# EAGLE design OneBoard (EAGLE 9.0.1)
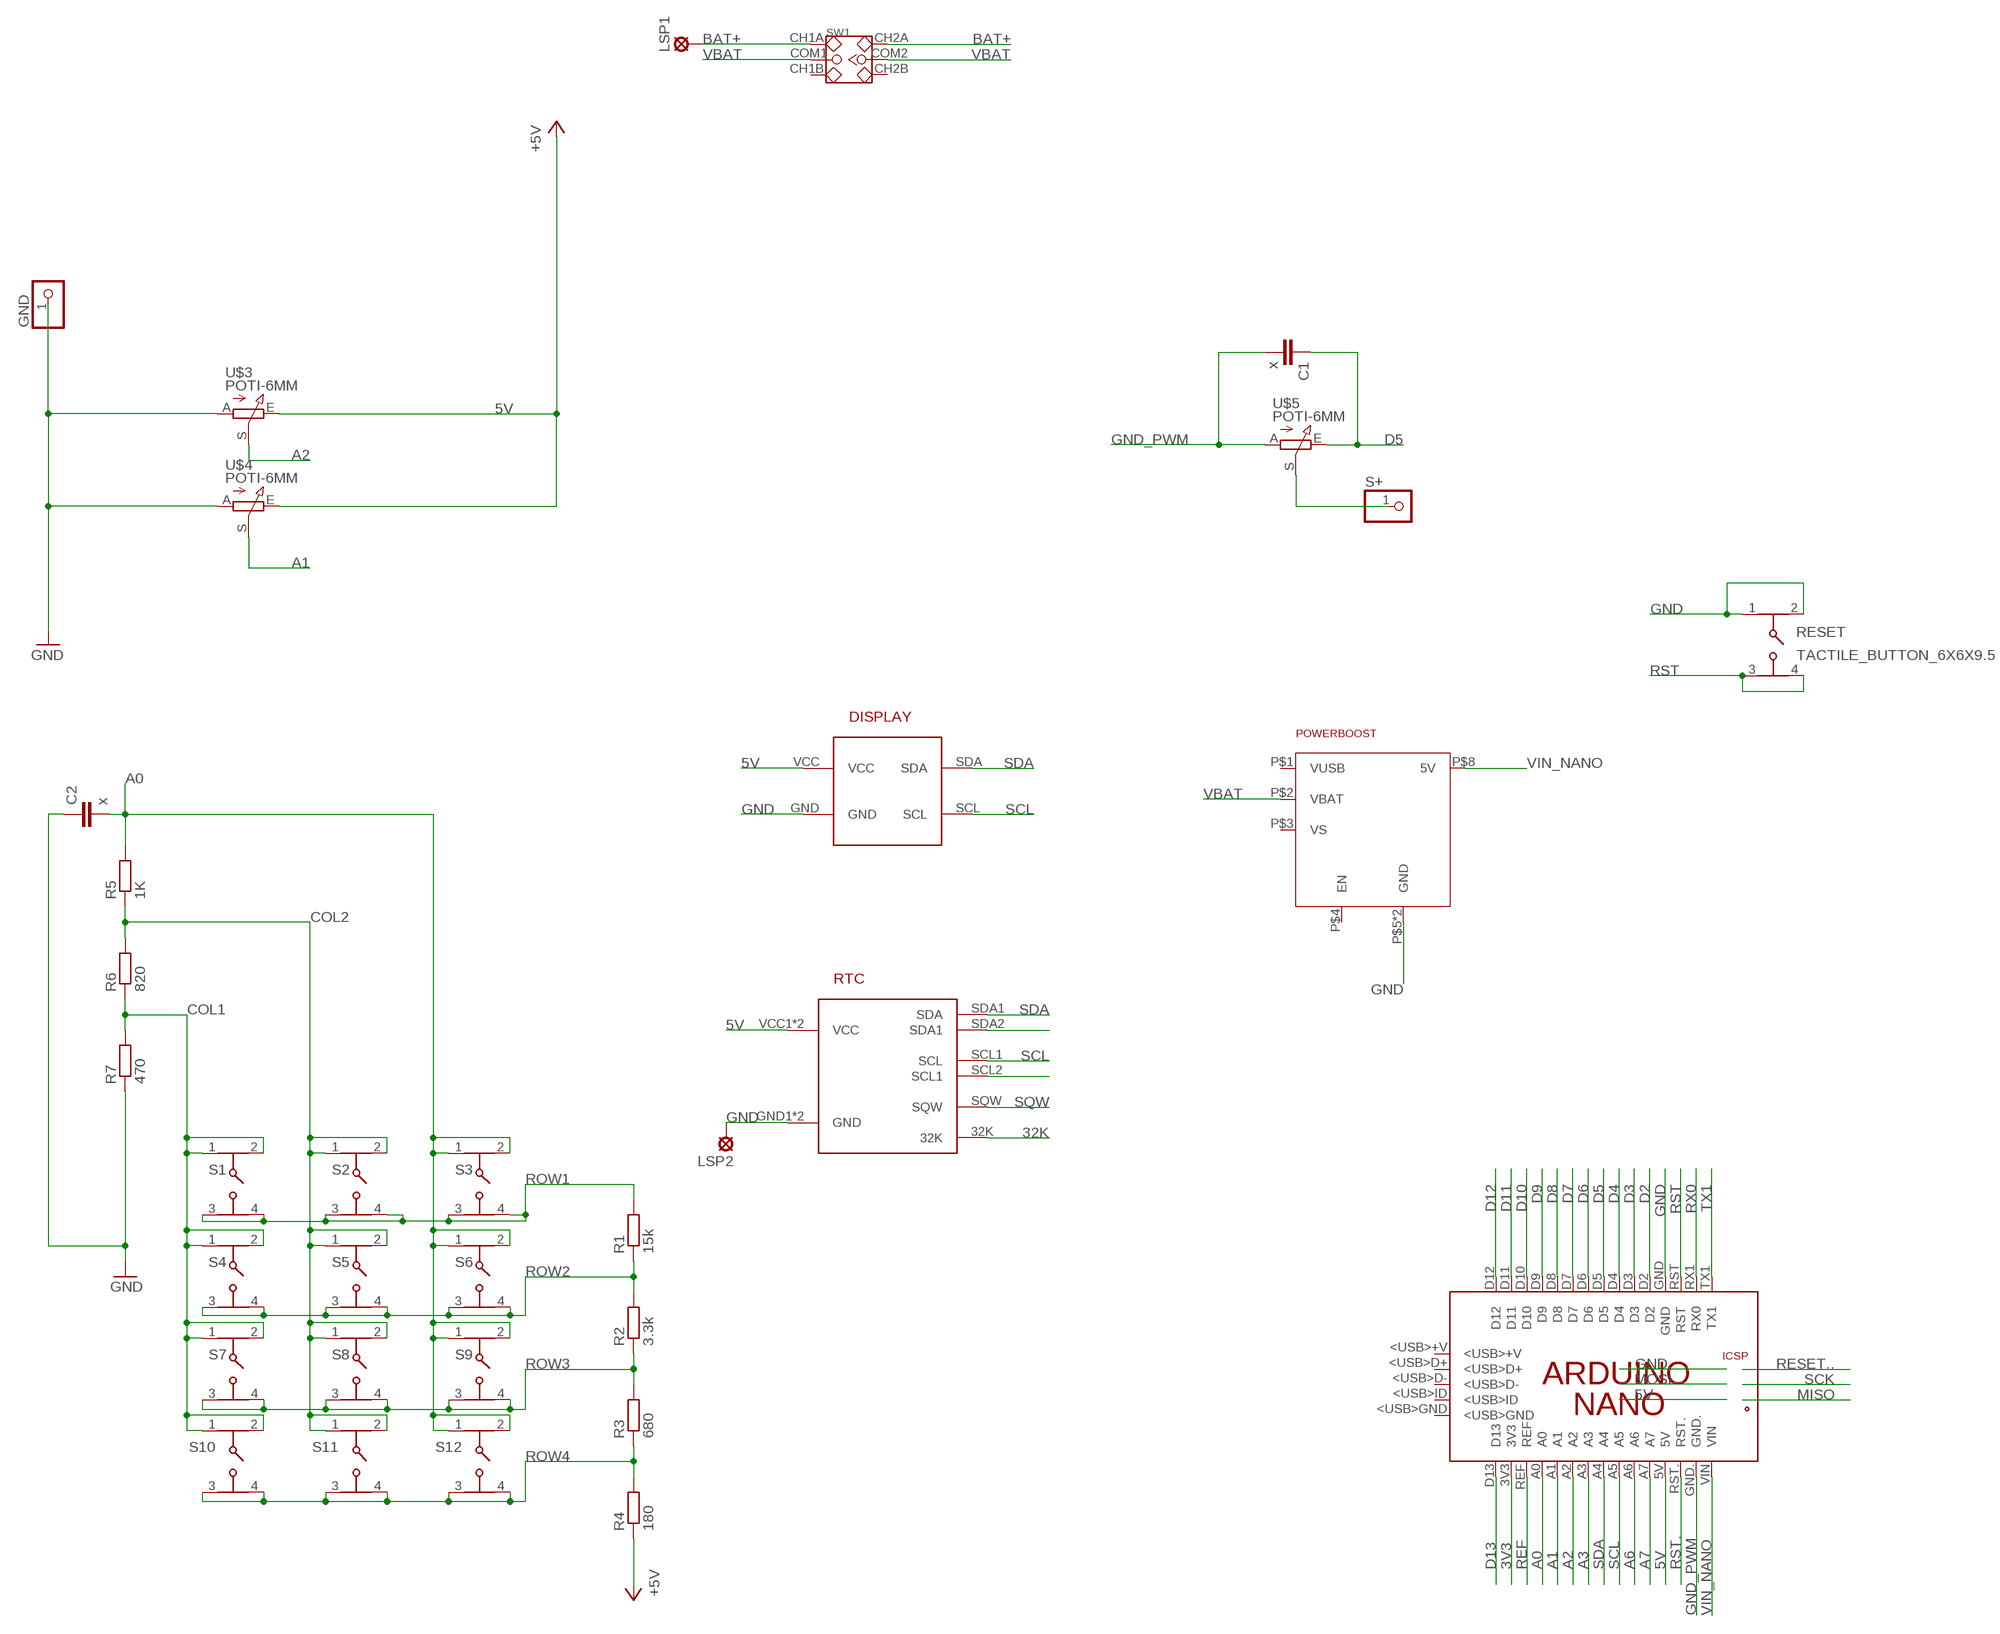
[diagram p0: schematic, sheet 1]

## Parts
C1  x  C-EU025-025X050  [C025-025X050]
C2  x  C-EU025-025X050  [C025-025X050]
DISPLAY  OLED_BREAKOUT  [OLED_128X32_BREAKOUT]
GND  PINHD-1X1  [1X01]
LSP1  LSP11  [LSP11]
LSP2  LSP11  [LSP11]
POWERBOOST  ADAFRUIT_POWERBOOST_1000C  [ADAFRUIT_POWERBOOST_1000C]
R1  15k  R-EU_R0603  [R0603]
R2  3.3k  R-EU_R0603  [R0603]
R3  680  R-EU_R0603  [R0603]
R4  180  R-EU_R0603  [R0603]
R5  1K  R-EU_R0603  [R0603]
R6  820  R-EU_R0603  [R0603]
R7  470  R-EU_R0603  [R0603]
RESET  TACTILE_BUTTON_6X6X9.5  [TACTILE_SWITCH_PTH_6.0MM]
RTC  DS3231_BREAKOUT  [DS3231_BREAKOUT]
S1  TACTILE_BUTTON_6X6X9.5  [TACTILE_SWITCH_PTH_6.0MM]
S2  TACTILE_BUTTON_6X6X9.5  [TACTILE_SWITCH_PTH_6.0MM]
S3  TACTILE_BUTTON_6X6X9.5  [TACTILE_SWITCH_PTH_6.0MM]
S4  TACTILE_BUTTON_6X6X9.5  [TACTILE_SWITCH_PTH_6.0MM]
S5  TACTILE_BUTTON_6X6X9.5  [TACTILE_SWITCH_PTH_6.0MM]
S6  TACTILE_BUTTON_6X6X9.5  [TACTILE_SWITCH_PTH_6.0MM]
S7  TACTILE_BUTTON_6X6X9.5  [TACTILE_SWITCH_PTH_6.0MM]
S8  TACTILE_BUTTON_6X6X9.5  [TACTILE_SWITCH_PTH_6.0MM]
S9  TACTILE_BUTTON_6X6X9.5  [TACTILE_SWITCH_PTH_6.0MM]
S10  TACTILE_BUTTON_6X6X9.5  [TACTILE_SWITCH_PTH_6.0MM]
S11  TACTILE_BUTTON_6X6X9.5  [TACTILE_SWITCH_PTH_6.0MM]
S12  TACTILE_BUTTON_6X6X9.5  [TACTILE_SWITCH_PTH_6.0MM]
S+  PINHD-1X1  [1X01]
SW1  DIP-TOGGLE-SWITCH-2CH-(2X3P-2.54)  [SW6-2.54-9.0X3.5X3.2+2.0MM]
U$3  POTI-6MM  [POTI-6MM]
U$4  POTI-6MM  [POTI-6MM]
U$5  POTI-6MM  [POTI-6MM]
U$7  ARDUINO-NANO  [ARDUINO_NANO]

## Nets
3V3: U$7.3V3
5V: DISPLAY.VCC R4.1 RTC.VCC1(VCC) RTC.VCC2(VCC) U$3.E U$4.E U$7.5V U$7.5V. ; supply symbol labelled +5V
32K [Signal]: RTC.32K
A0 [Signal]: C2.2 R5.2 S3.1 S3.2 S6.1 S6.2 S9.1 S9.2 S12.1 S12.2 U$7.A0
A1 [Signal]: U$4.S U$7.A1
A2 [Signal]: U$3.S U$7.A2
A3 [Signal]: U$7.A3
A6: U$7.A6
A7: U$7.A7
BAT+: LSP1.MP SW1.CH1A SW1.CH2A
COL1: R6.1 R7.2 S1.1 S1.2 S4.1 S4.2 S7.1 S7.2 S10.1 S10.2
COL2: R5.1 R6.2 S2.1 S2.2 S5.1 S5.2 S8.1 S8.2 S11.1 S11.2
D2: U$7.D2
D3: U$7.D3
D4: U$7.D4
D5: C1.1 U$5.E U$7.D5
D6: U$7.D6
D7: U$7.D7
D8: U$7.D8
D9: U$7.D9
D10: U$7.D10
D11: U$7.D11
D12: U$7.D12
D13: U$7.D13
GND: C2.1 DISPLAY.GND GND.1 LSP2.MP POWERBOOST.P$5(GND) POWERBOOST.P$7(GND) R7.1 RESET.1 RESET.2 RTC.GND1(GND) RTC.GND2(GND) U$3.A U$4.A U$7.GND U$7.GND_
GND_PWM [Signal]: C1.2 U$5.A U$7.GND.
MISO: U$7.MISO
MOSI: U$7.MOSI
N$1: RTC.SDA2(SDA1)
N$2: RTC.SCL2(SCL1)
REF: U$7.REF
RESET..: U$7.RESET..
ROW1: R1.2 S1.3 S1.4 S2.3 S2.4 S3.3 S3.4
ROW2: R1.1 R2.2 S4.3 S4.4 S5.3 S5.4 S6.3 S6.4
ROW3: R2.1 R3.2 S7.3 S7.4 S8.3 S8.4 S9.3 S9.4
ROW4: R3.1 R4.2 S10.3 S10.4 S11.3 S11.4 S12.3 S12.4
RST: RESET.3 RESET.4 U$7.RST
RST.: U$7.RST.
RX0: U$7.RX1(RX0)
S+ [Signal]: S+.1 U$5.S
SCK: U$7.SCK
SCL [Signal]: DISPLAY.SCL RTC.SCL1(SCL) U$7.A5
SDA [Signal]: DISPLAY.SDA RTC.SDA1(SDA) U$7.A4
SQW [Signal]: RTC.SQW
TX1: U$7.TX1
VBAT: POWERBOOST.P$2(VBAT) SW1.COM1 SW1.COM2
VIN_NANO: POWERBOOST.P$8(5V) U$7.VIN
Unconnected: POWERBOOST.P$4(EN) SW1.CH1B SW1.CH2B U$7.<USB>+V U$7.<USB>D+ U$7.<USB>D- U$7.<USB>GND U$7.<USB>ID

## Power pins joined to a net without a drawn wire
VS: POWERBOOST.P$3(VS)
VUSB: POWERBOOST.P$1(VUSB)

## Library data of the parts
C1 C2 = rcl:C-EU: CAPACITOR, European symbol; SPICEPREFIX: C
DISPLAY = My Breakout Boards:OLED_BREAKOUT
GND S+ = pinhead:PINHD-1X1: PIN HEADER
LSP1 LSP2 = solpad:LSP11: SOLDER PAD drill 1.1 mm
POWERBOOST = My Breakout Boards:ADAFRUIT_POWERBOOST_1000C
R1-R7 = rcl:R-EU_: RESISTOR, European symbol; SPICEPREFIX: R
RESET S1-S12 = Pat Sonstiges:TACTILE_BUTTON_6X6X9.5
RTC = My Breakout Boards:DS3231_BREAKOUT
SW1 = Seeed-Switch:DIP-TOGGLE-SWITCH-2CH-(2X3P-2.54): 311010004; MPN: MS-22D18 G2 ROHS
U$3-U$5 = Pat Sonstiges:POTI-
U$7 = My Boards:ARDUINO-NANO

## Net classes
0 GND: width 0.254 mm, drill 0.8 mm, clearance 0.254 mm
1 Signal: width 0.254 mm, drill 0.8 mm, clearance 0.254 mm to class 0, clearance 0.254 mm

## Board
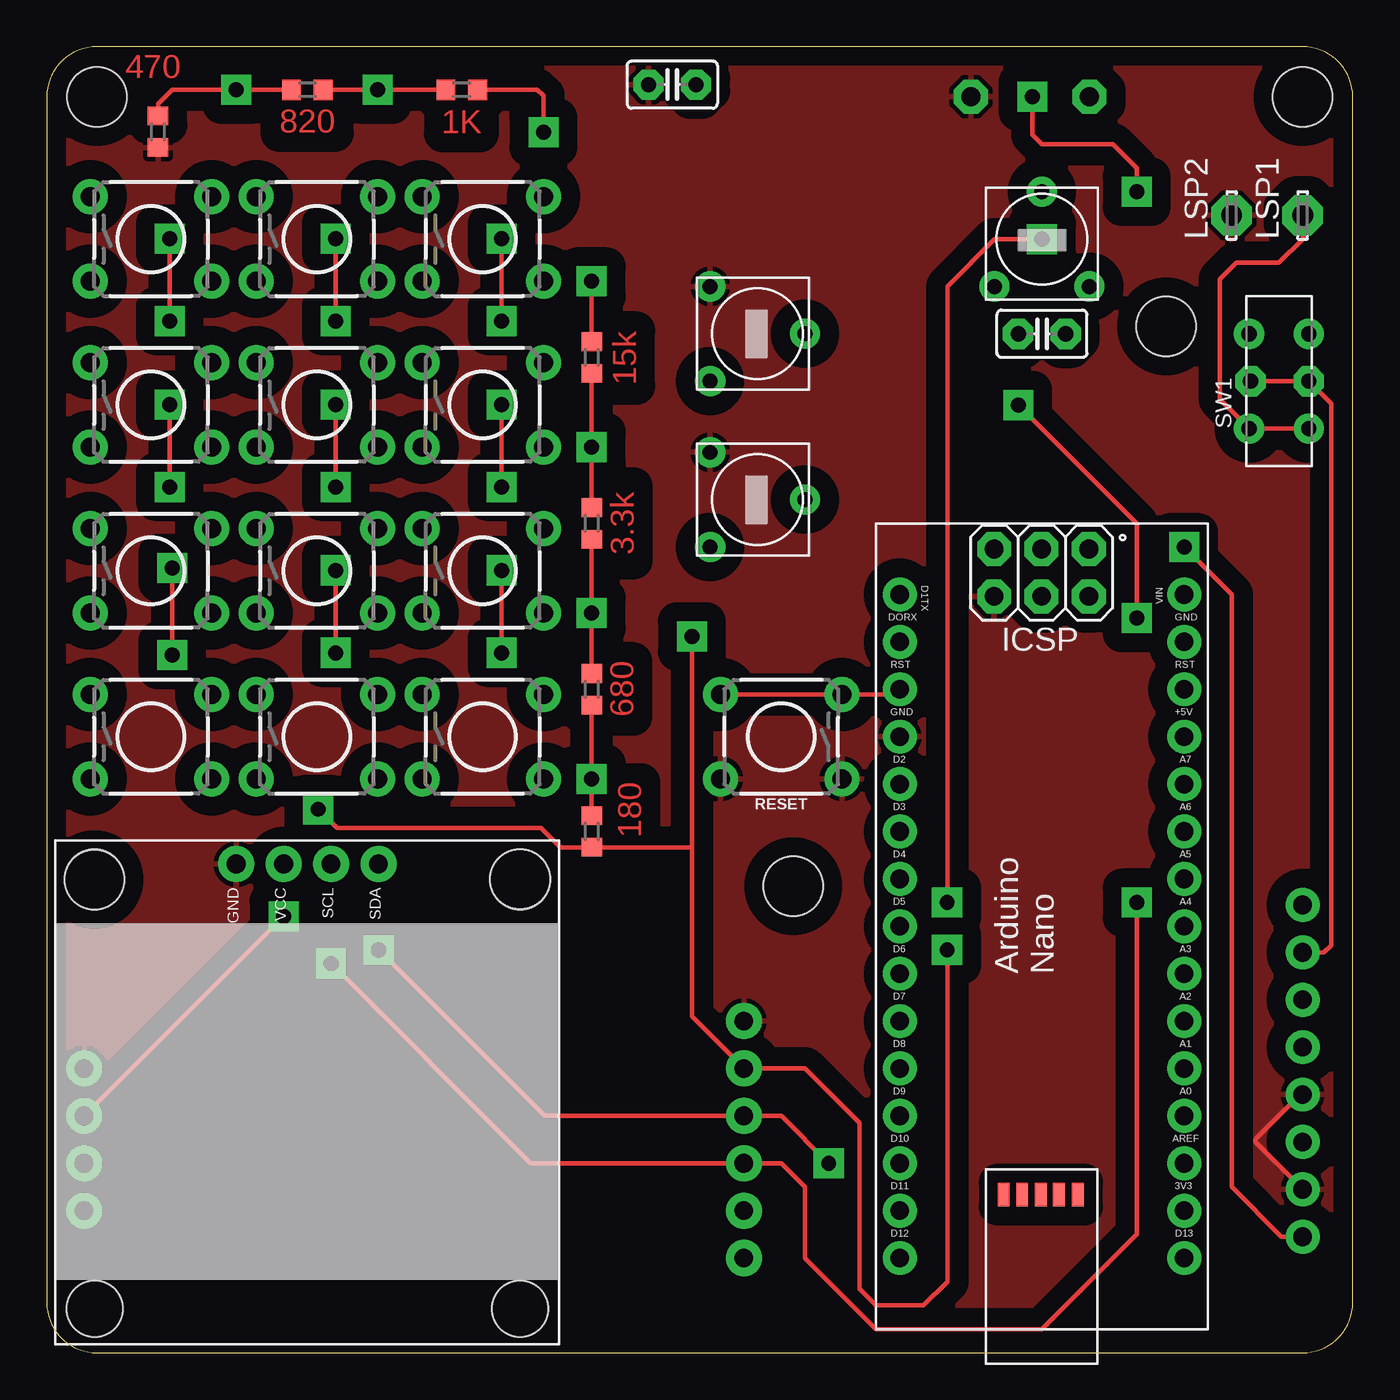
[diagram p1: board, top side]
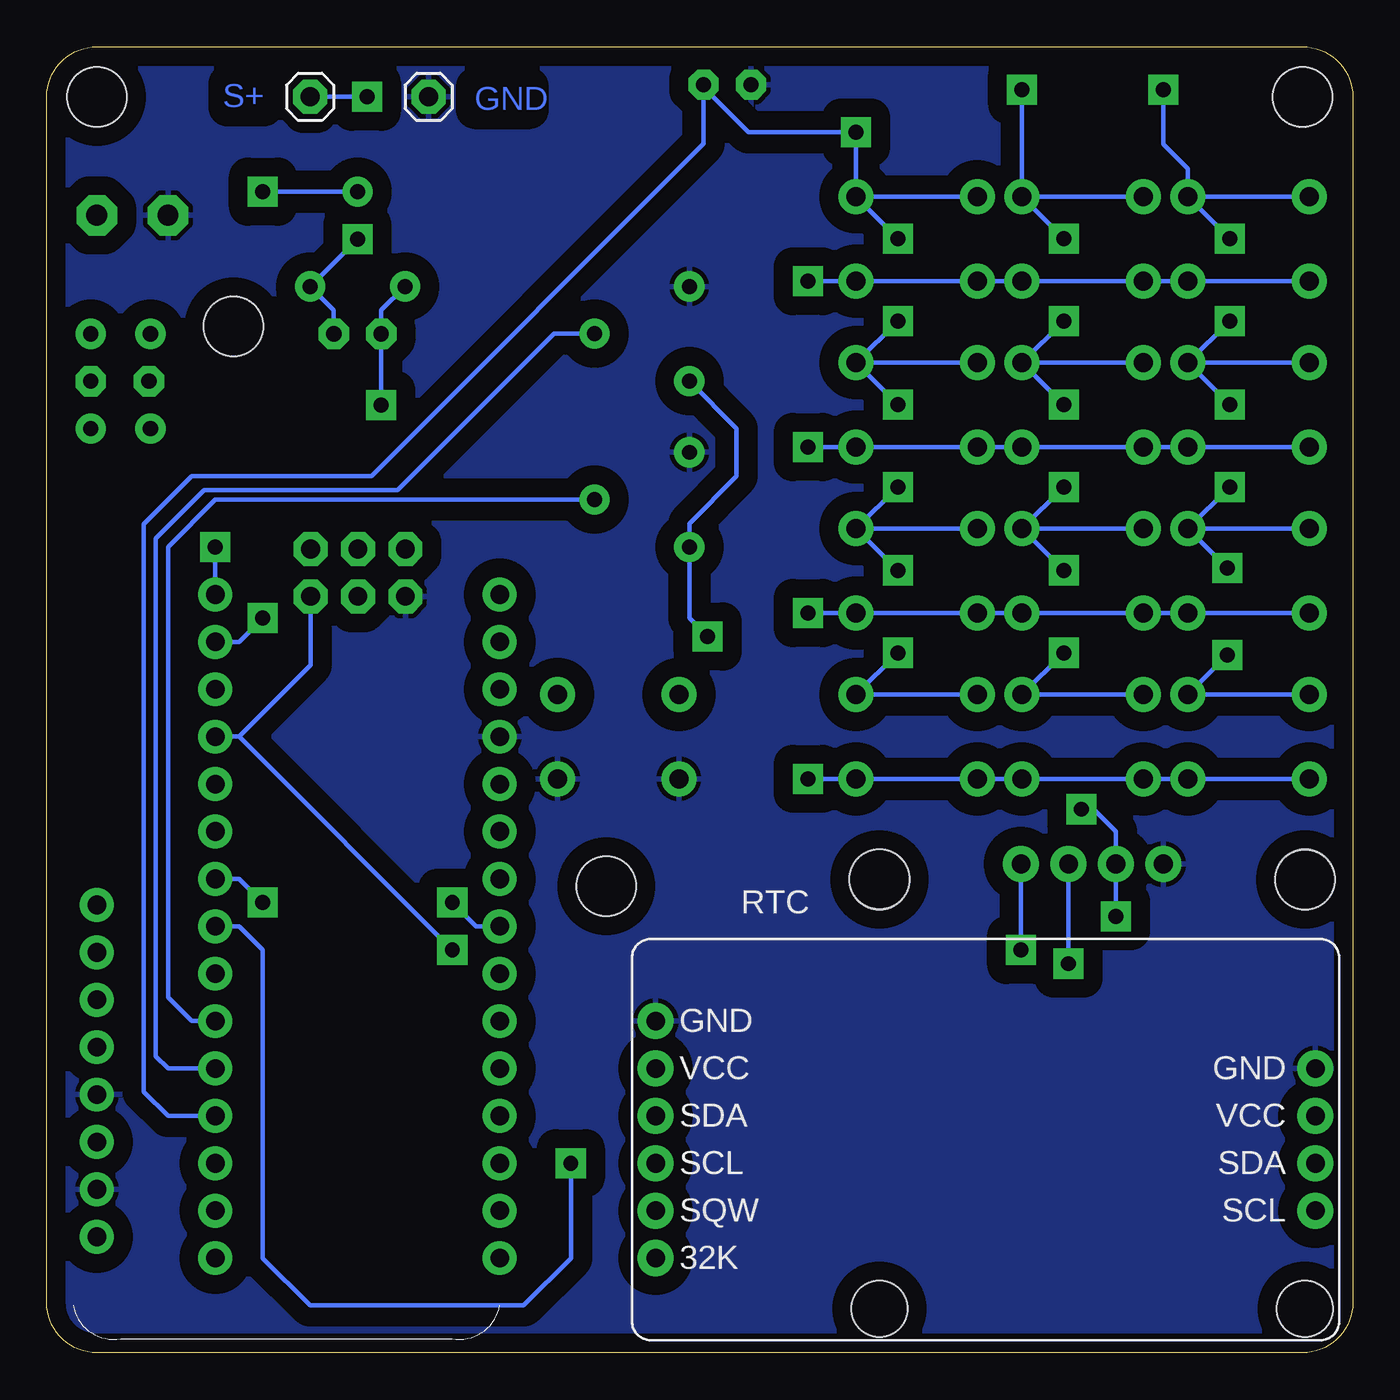
[diagram p2: board, bottom side, seen from below]

Size 70 x 70 mm. Coordinates in mm from the lower left corner, seen from the top.
Outline: 0,67.3 0,2.7 arc90 2.7,0 67.3,0 arc90 70,2.7 70,67.3 arc90 67.3,70 2.7,70 arc90 0,67.3
Copper layers (1*16): Top 0.035mm / dielectric 1.5mm / Bottom 0.035mm
Design rules "MakerSpace": minimum track width 8mil, minimum drill 0.6mm, track to track 8mil, track to pad 8mil, pad to pad 8mil, via to via 8mil, smd to smd 8mil, copper to edge 40mil, drill to drill 10mil, minimum pad ring 16mil, minimum via ring 16mil, stop-mask expansion 4mil, vias tented up to drill 0mil, thermal gap 10mil
Holes 3.2 mm at 2.7,67.3 67.3,67.3 2.57,25.36 25.37,25.37 40,25 60,55

### Footprints (pad centres in the part's own frame; a part is rotated, then mirrored left to right if it is on the bottom)
C025-025X050 = drill 0.813 octagon: 1 -1.27,0; 2 1.27,0
OLED_128X32_BREAKOUT = drill 1 pad 1.93: GND 3.81,-12.23; SCL -1.27,-12.23; SDA -3.81,-12.23; VCC 1.27,-12.23 | hole 3.2: 11.4,-11.4; -11.4,-11.4 | hole 3: 11.4,11.6; -11.4,11.6
1X01 = drill 1.016 octagon: 1 0,0
LSP11 = drill 1.118 pad 2.159 octagon: MP 0,0
ADAFRUIT_POWERBOOST_1000C = drill 1: P$1 12.827,1.27; P$2 15.367,1.27; P$3 17.907,1.27; P$4 20.447,1.27; P$5 22.987,1.27; P$6 25.527,1.27; P$7 28.067,1.27; P$8 30.607,1.27
R0603 = smd 1 x 1.1: 1 -0.85,0; 2 0.85,0
TACTILE_SWITCH_PTH_6.0MM = drill 1.016 pad 1.88: 1 -3.251,2.261; 2 3.251,2.261; 3 -3.251,-2.261; 4 3.251,-2.261
DS3231_BREAKOUT = drill 1 pad 1.93: 32K -17.68,-6.35; GND1 -17.68,6.35; GND2 17.68,3.81; SCL1 -17.68,-1.27; SCL2 17.68,-3.81; SDA1 -17.68,1.27; SDA2 17.68,-1.27; SQW -17.68,-3.81; VCC1 -17.68,3.81; VCC2 17.68,1.27
SW6-2.54-9.0X3.5X3.2+2.0MM = drill 0.813 pad 1.27: CH1A -2.54,-1.6; CH1B 2.54,-1.6; CH2A -2.54,1.6; CH2B 2.54,1.6 | drill 0.813 pad 1.27 octagon: COM1 0,-1.6; COM2 0,1.524
POTI-6MM = drill 0.8: A -2.54,-2.54; E 2.54,-2.54; S 0,2.54
ARDUINO_NANO = drill 1 pad 1.778: 3V3 6.35,1.27; 5V 31.75,1.27; A0 11.43,1.27; A1 13.97,1.27; A2 16.51,1.27; A3 19.05,1.27; A4 21.59,1.27; A5 24.13,1.27; A6 26.67,1.27; A7 29.21,1.27; D2 29.21,16.51; D3 26.67,16.51; D4 24.13,16.51; D5 21.59,16.51; D6 19.05,16.51; D7 16.51,16.51; D8 13.97,16.51; D9 11.43,16.51; D10 8.89,16.51; D11 6.35,16.51; D12 3.81,16.51; D13 3.81,1.27; GND 31.75,16.51; GND. 36.83,1.27; REF 8.89,1.27; RST 34.29,16.51; RST. 34.29,1.27; RX1 36.83,16.51; TX1 39.37,16.51; VIN 39.37,1.27 | drill 1 pad 1.778 octagon: 5V. 39.268,6.375; GND_ 39.268,11.455; MISO 41.808,6.375; MOSI 39.268,8.915; RESET.. 41.808,11.455; SCK 41.808,8.915 | smd 1.27 x 0.635: <USB>+V 7.214,10.947; <USB>D+ 7.214,9.957; <USB>D- 7.214,8.941; <USB>GND 7.214,6.96; <USB>ID 7.214,7.976

### Placement (x,y rotation side)
C1  53.34,54.61 180 top
C2  33.53,67.96 0 top
DISPLAY  13.97,13.97 180 top
GND  49.53,67.31 0 bottom
LSP1  67.31,60.96 90 top
LSP2  63.5,60.96 90 top
POWERBOOST  68.58,36.83 270 bottom
R1  29.21,53.34 90 top
R2  29.21,44.45 90 top
R3  29.21,35.56 90 top
R4  29.21,27.94 90 top
R5  22.24,67.69 0 top
R6  13.97,67.69 0 top
R7  5.97,65.44 90 top
RESET  39.37,33.02 180 top
RTC  19.68,11.43 0 bottom
S1  5.59,59.69 0 top
S2  14.48,59.69 0 top
S3  23.37,59.69 0 top
S4  5.59,50.8 0 top
S5  14.48,50.8 0 top
S6  23.37,50.8 0 top
S7  5.59,41.91 0 top
S8  14.48,41.91 0 top
S9  23.37,41.91 0 top
S10  5.59,33.02 0 top
S11  14.48,33.02 0 top
S12  23.37,33.02 0 top
S+  55.88,67.31 0 bottom
SW1  66.04,52.07 90 top
U$3  38.1,45.72 270 top
U$4  38.1,54.61 270 top
U$5  53.34,59.69 0 top
U$7  62.23,1.27 90 top

### Tracks (layer width: path | path; a pad name or v marks a point on that pad's centre or on a via)
5V  (via drill 0.8)
  Top 0.254: 34.58,27.09 R4.1 27.53,27.09 26.51,28.12 15.57,28.12 v14.55,29.13 | 34.58,27.09 v34.58,38.39 | RTC.VCC2 v12.7,23.4 | 34.58,27.09 34.58,18.02 RTC.VCC1 40.64,15.24 43.56,12.32 43.56,3.43 44.45,2.54 46.99,2.54 48.26,3.81 v48.26,21.59
  Bottom 0.254: v34.58,38.39 35.56,39.37 U$3.E 35.56,44.45 33.02,46.99 33.02,49.53 U$4.E | v12.7,23.4 DISPLAY.VCC 12.7,27.94 13.89,29.13 v14.55,29.13 | 59.69,33.02 v48.26,21.59 | 59.69,33.02 U$7.5V | 59.69,33.02 55.85,36.85 U$7.5V.
A0  (via drill 0.8)
  Top 0.254: v24.38,37.52 v24.38,41.94 | v24.38,46.41 v24.38,50.83 | v24.38,55.3 v24.38,59.72 | v26.62,65.41 26.62,67.36 26.29,67.69 R5.2
  Bottom 0.254: S3.2 v26.62,65.41 32.38,65.41 34.8,67.82 | S3.1 S3.2 | S12.1 S12.2 v24.38,37.52 | S9.1 S9.2 | S6.1 S6.2 | v24.38,41.94 S9.2 | S9.2 v24.38,46.41 | v24.38,50.83 S6.2 | S6.2 v24.38,55.3 | v24.38,59.72 S3.2 | U$7.A0 63.5,12.7 64.8,14 64.8,44.42 62.23,46.99 52.59,46.99 34.8,64.79 34.8,67.82 | 34.8,67.82 C2.2
A1
  Bottom 0.254: U$4.S 42.8,54.61 51.18,46.23 61.56,46.23 64.16,43.64 64.16,15.9 63.5,15.24 U$7.A1
A2
  Bottom 0.254: U$7.A2 62.23,17.78 63.5,19.05 63.5,43.18 60.96,45.72 U$3.S
BAT+
  Top 0.254: SW1.CH1A SW1.CH2A 62.87,51.1 62.87,57.53 63.75,58.42 66.04,58.42 67.31,59.69 LSP1.MP
COL1  (via drill 0.8)
  Top 0.254: R6.1 v10.16,67.69 6.73,67.69 5.97,66.93 R7.2 | v6.6,55.3 v6.6,59.72 | v6.6,50.83 v6.6,46.41 | v6.73,42.06 v6.73,37.39
  Bottom 0.254: S1.1 S1.2 | S10.1 S10.2 v6.73,37.39 | S7.2 S7.1 | S4.1 S4.2 | S1.2 8.84,63.45 10.16,64.77 v10.16,67.69 | v6.6,46.41 S7.2 | S4.2 v6.6,55.3 | v6.6,59.72 S1.2 | S4.2 v6.6,50.83 | S7.2 v6.73,42.06
COL2  (via drill 0.8)
  Top 0.254: R6.2 v17.73,67.69 R5.1 | v15.49,59.72 v15.49,55.3 | v15.49,50.83 v15.49,46.41 | v15.49,41.94 v15.49,37.52
  Bottom 0.254: v17.73,67.69 S2.2 | S2.2 S2.1 | S11.1 S11.2 v15.49,37.52 | S8.1 S8.2 | S5.1 S5.2 | S2.2 v15.49,59.72 | v15.49,55.3 S5.2 | S5.2 v15.49,50.83 | v15.49,46.41 S8.2 | S8.2 v15.49,41.94
D5  (via drill 0.8)
  Top 0.254: v48.26,24.13 48.26,57.15 50.8,59.69 v53.34,59.69
  Bottom 0.254: C1.1 54.61,55.88 U$5.E v53.34,59.69 | U$7.D5 46.99,22.86 v48.26,24.13
GND
  Top 0.254: POWERBOOST.P$7 64.77,11.3 64.77,11.43 67.18,13.84 POWERBOOST.P$5
  pour Top (isolate 1.016): 0,0 71.12,0 71.12,71.12 0,71.12
  pour Bottom (isolate 1.016): 0,0 71.12,0 71.12,71.12 0,71.12
GND_PWM  (via drill 0.8)
  Top 0.254: v58.42,39.37 58.42,44.45 v52.07,50.8
  Bottom 0.254: U$5.A 52.07,55.88 C1.2 v52.07,50.8 | U$7.GND. 59.69,38.1 v58.42,39.37
ROW1  (via drill 0.8)
  Top 0.254: v29.21,57.43 R1.2
  Bottom 0.254: S1.3 S1.4 S2.3 S2.4 S3.3 S3.4 v29.21,57.43
ROW2  (via drill 0.8)
  Top 0.254: R2.2 v29.21,48.54 R1.1
  Bottom 0.254: v29.21,48.54 S6.4 S6.3 S5.4 S5.3 S4.4 S4.3
ROW3  (via drill 0.8)
  Top 0.254: R3.2 v29.21,39.65 R2.1
  Bottom 0.254: S7.3 S7.4 S8.3 S8.4 S9.3 S9.4 v29.21,39.65
ROW4  (via drill 0.8)
  Top 0.254: R4.2 v29.21,30.76 R3.1
  Bottom 0.254: S10.3 S10.4 S11.3 S11.4 S12.3 S12.4 v29.21,30.76
RST
  Top 0.254: RESET.4 RESET.3 45.44,35.28 U$7.RST
S+  (via drill 0.8)
  Top 0.254: v58.42,62.23 58.42,63.5 57.15,64.77 53.34,64.77 52.83,65.28 v52.83,67.31
  Bottom 0.254: U$5.S v58.42,62.23 | v52.83,67.31 S+.1
SCL  (via drill 0.8)
  Top 0.254: v15.24,20.86 25.94,10.16 RTC.SCL1 39.37,10.16 40.64,8.89 40.64,5.08 44.45,1.27 53.34,1.27 58.42,6.35 v58.42,24.13
  Bottom 0.254: v15.24,20.86 DISPLAY.SCL | v58.42,24.13 59.69,25.4 U$7.A5
SDA  (via drill 0.8)
  Top 0.254: v17.78,21.59 26.67,12.7 RTC.SDA1 39.37,12.7 v41.91,10.16
  Bottom 0.254: v17.78,21.59 DISPLAY.SDA 17.78,25.94 | v41.91,10.16 41.91,5.08 44.45,2.54 55.88,2.54 58.42,5.08 58.42,21.59 59.69,22.86 U$7.A4
VBAT
  Top 0.254: SW1.COM2 SW1.COM1 68.83,50.88 68.83,21.84 68.45,21.46 POWERBOOST.P$2
VIN_NANO  (via drill 0.8)
  Top 0.254: v60.96,43.18 63.5,40.64 63.5,8.89 66.17,6.22 POWERBOOST.P$8
  Bottom 0.254: U$7.VIN v60.96,43.18